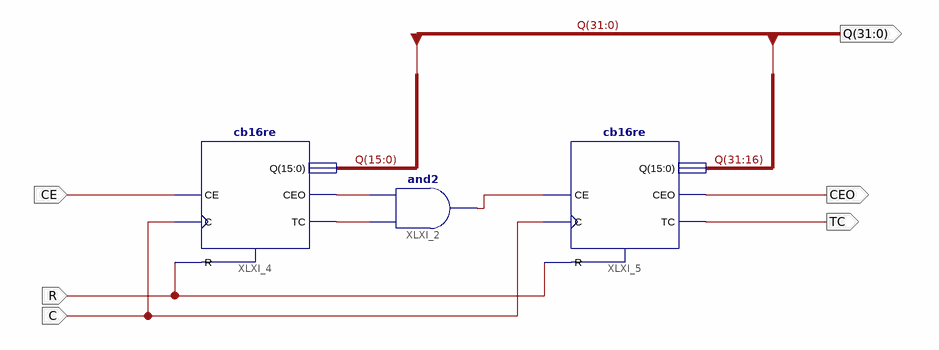
[diagram p0: schematic sheet 1]
// Xilinx ISE schematic cb32re.sch (spartan6) as structural Verilog: 3 symbols, 6 ports
module cb32re (
  input  C,
  input  R,
  input  CE,
  output TC,
  output CEO,
  output [31:0] Q
);

  wire XLXN_5, XLXN_6, XLXN_7;

  and XLXI_2 (XLXN_7, XLXN_6, XLXN_5);
  cb16re XLXI_4 (.C(C), .CE(CE), .R(R), .CEO(XLXN_5), .Q(Q[15:0]), .TC(XLXN_6));
  cb16re XLXI_5 (.C(C), .CE(XLXN_7), .R(R), .CEO(CEO), .Q(Q[31:16]), .TC(TC));
endmodule
